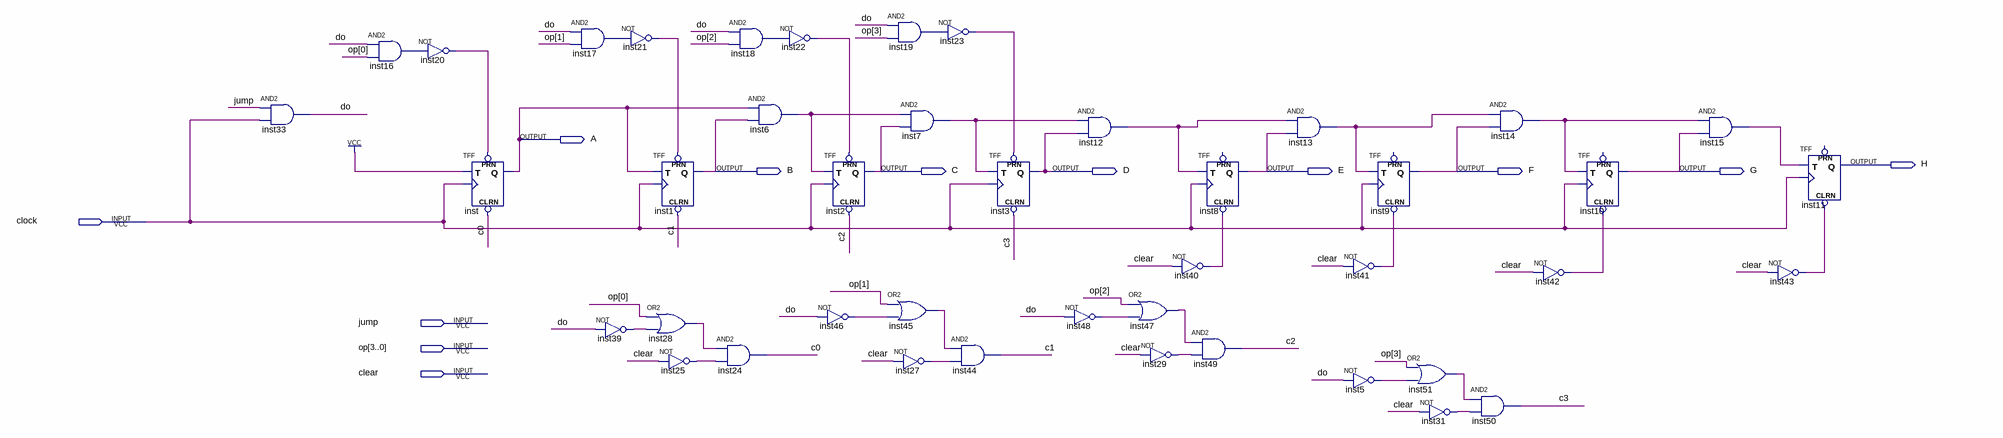
[diagram p0: schematic sheet]
// Quartus schematic contador.bdf as structural Verilog: 43 symbols, 12 pins
module contador (
  input  clock,
  input  jump,
  input  [3:0] op,
  input  clear,
  output A,
  output H,
  output B,
  output C,
  output D,
  output E,
  output F,
  output G
);

  wire c0, c1, c2, c3, \do , inst5_out, inst6_out, inst7_out, inst12_out, inst13_out, inst14_out, inst15_out,
       inst16_out, inst17_out, inst18_out, inst19_out, inst20_out, inst21_out, inst22_out, inst23_out,
       inst25_out, inst27_out, inst28_out, inst29_out, inst31_out, inst39_out, inst40_out, inst41_out,
       inst42_out, inst43_out, inst45_out, inst46_out, inst47_out, inst48_out, inst51_out;

  and inst33 (\do , jump, clock);
  and inst16 (inst16_out, \do , op[0]);
  not inst20 (inst20_out, inst16_out);
  TFF inst (.PRN(inst20_out), .CLRN(c0), .T(1'b1), .CLK(clock), .Q(A));
  and inst17 (inst17_out, \do , op[1]);
  not inst21 (inst21_out, inst17_out);
  not inst39 (inst39_out, \do );
  TFF inst1 (.PRN(inst21_out), .CLRN(c1), .T(A), .CLK(clock), .Q(B));
  or inst28 (inst28_out, op[0], inst39_out);
  not inst25 (inst25_out, clear);
  and inst24 (c0, inst28_out, inst25_out);
  and inst18 (inst18_out, \do , op[2]);
  and inst6 (inst6_out, A, B);
  not inst22 (inst22_out, inst18_out);
  TFF inst2 (.PRN(inst22_out), .CLRN(c2), .T(inst6_out), .CLK(clock), .Q(C));
  not inst46 (inst46_out, \do );
  and inst19 (inst19_out, \do , op[3]);
  and inst7 (inst7_out, inst6_out, C);
  or inst45 (inst45_out, op[1], inst46_out);
  not inst27 (inst27_out, clear);
  not inst23 (inst23_out, inst19_out);
  and inst44 (c1, inst45_out, inst27_out);
  TFF inst3 (.PRN(inst23_out), .CLRN(c3), .T(inst7_out), .CLK(clock), .Q(D));
  and inst12 (inst12_out, inst7_out, D);
  not inst48 (inst48_out, \do );
  or inst47 (inst47_out, op[2], inst48_out);
  not inst40 (inst40_out, clear);
  not inst29 (inst29_out, clear);
  TFF inst8 (.CLRN(inst40_out), .T(inst12_out), .CLK(clock), .Q(E));  // open: PRN
  and inst49 (c2, inst47_out, inst29_out);
  and inst13 (inst13_out, inst12_out, E);
  TFF inst9 (.CLRN(inst41_out), .T(inst13_out), .CLK(clock), .Q(F));  // open: PRN
  not inst41 (inst41_out, clear);
  not inst5 (inst5_out, \do );
  or inst51 (inst51_out, op[3], inst5_out);
  not inst31 (inst31_out, clear);
  and inst50 (c3, inst51_out, inst31_out);
  and inst14 (inst14_out, inst13_out, F);
  not inst42 (inst42_out, clear);
  TFF inst10 (.CLRN(inst42_out), .T(inst14_out), .CLK(clock), .Q(G));  // open: PRN
  and inst15 (inst15_out, inst14_out, G);
  not inst43 (inst43_out, clear);
  TFF inst11 (.CLRN(inst43_out), .T(inst15_out), .CLK(clock), .Q(H));  // open: PRN
endmodule
